# EAGLE design PSPS_AVNC_SRD_power-2020-10-17 (EAGLE 9.6.2)
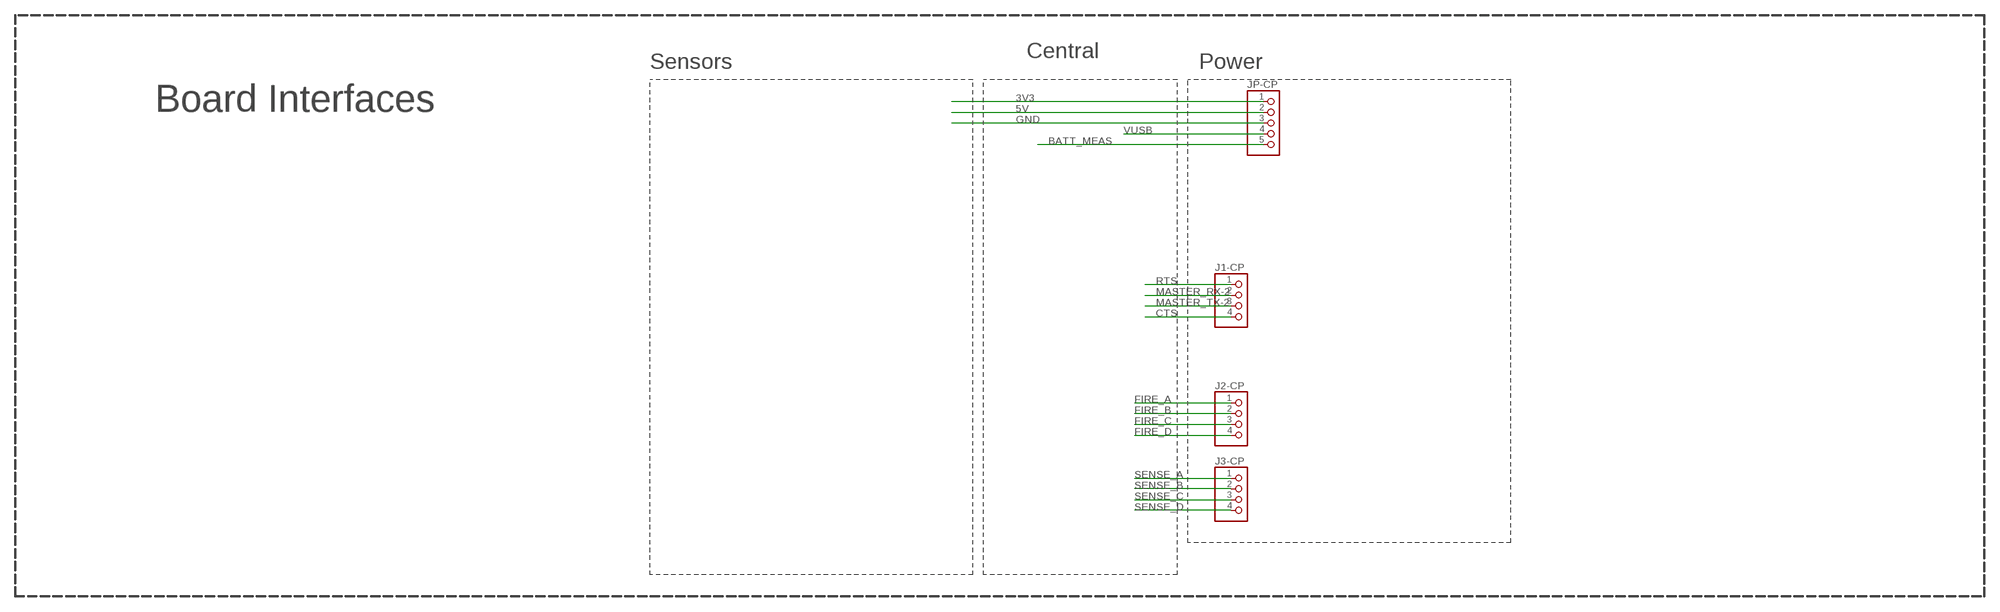
[diagram p0: schematic, sheet 1, part 1 of 3]
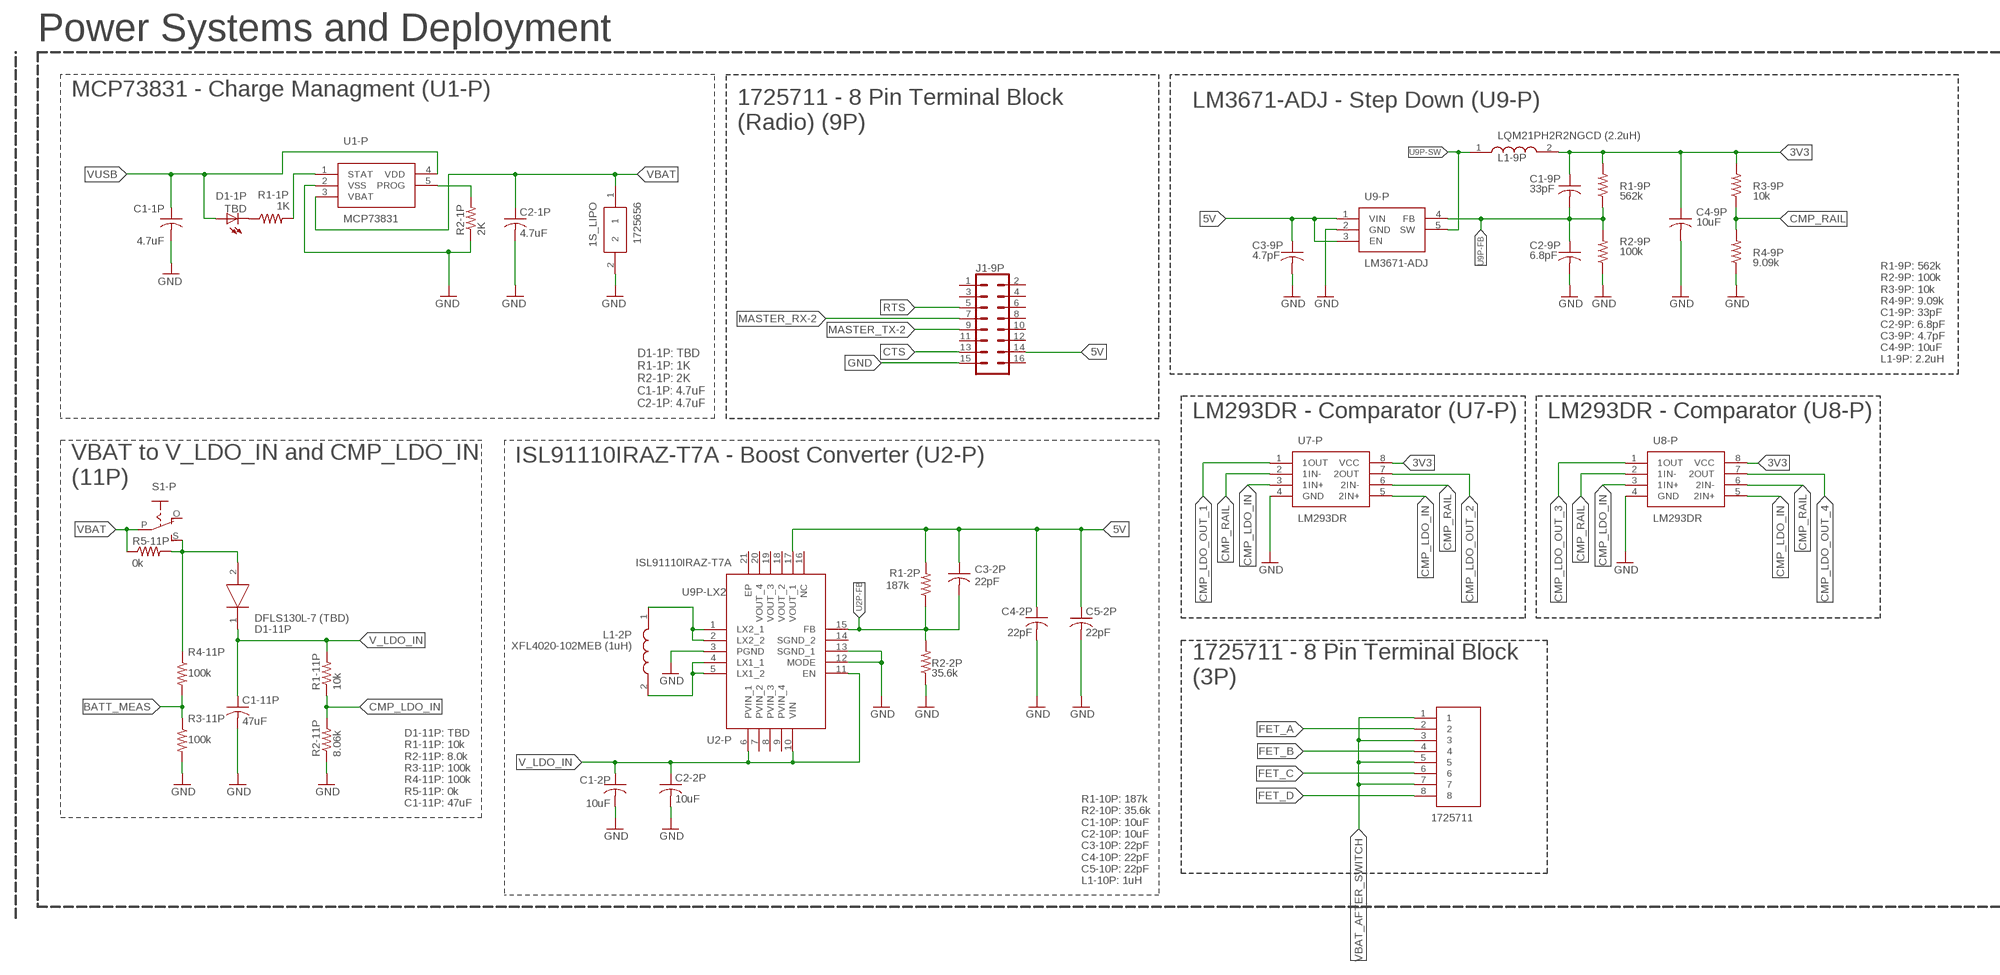
[diagram p1: schematic, sheet 1, part 2 of 3]
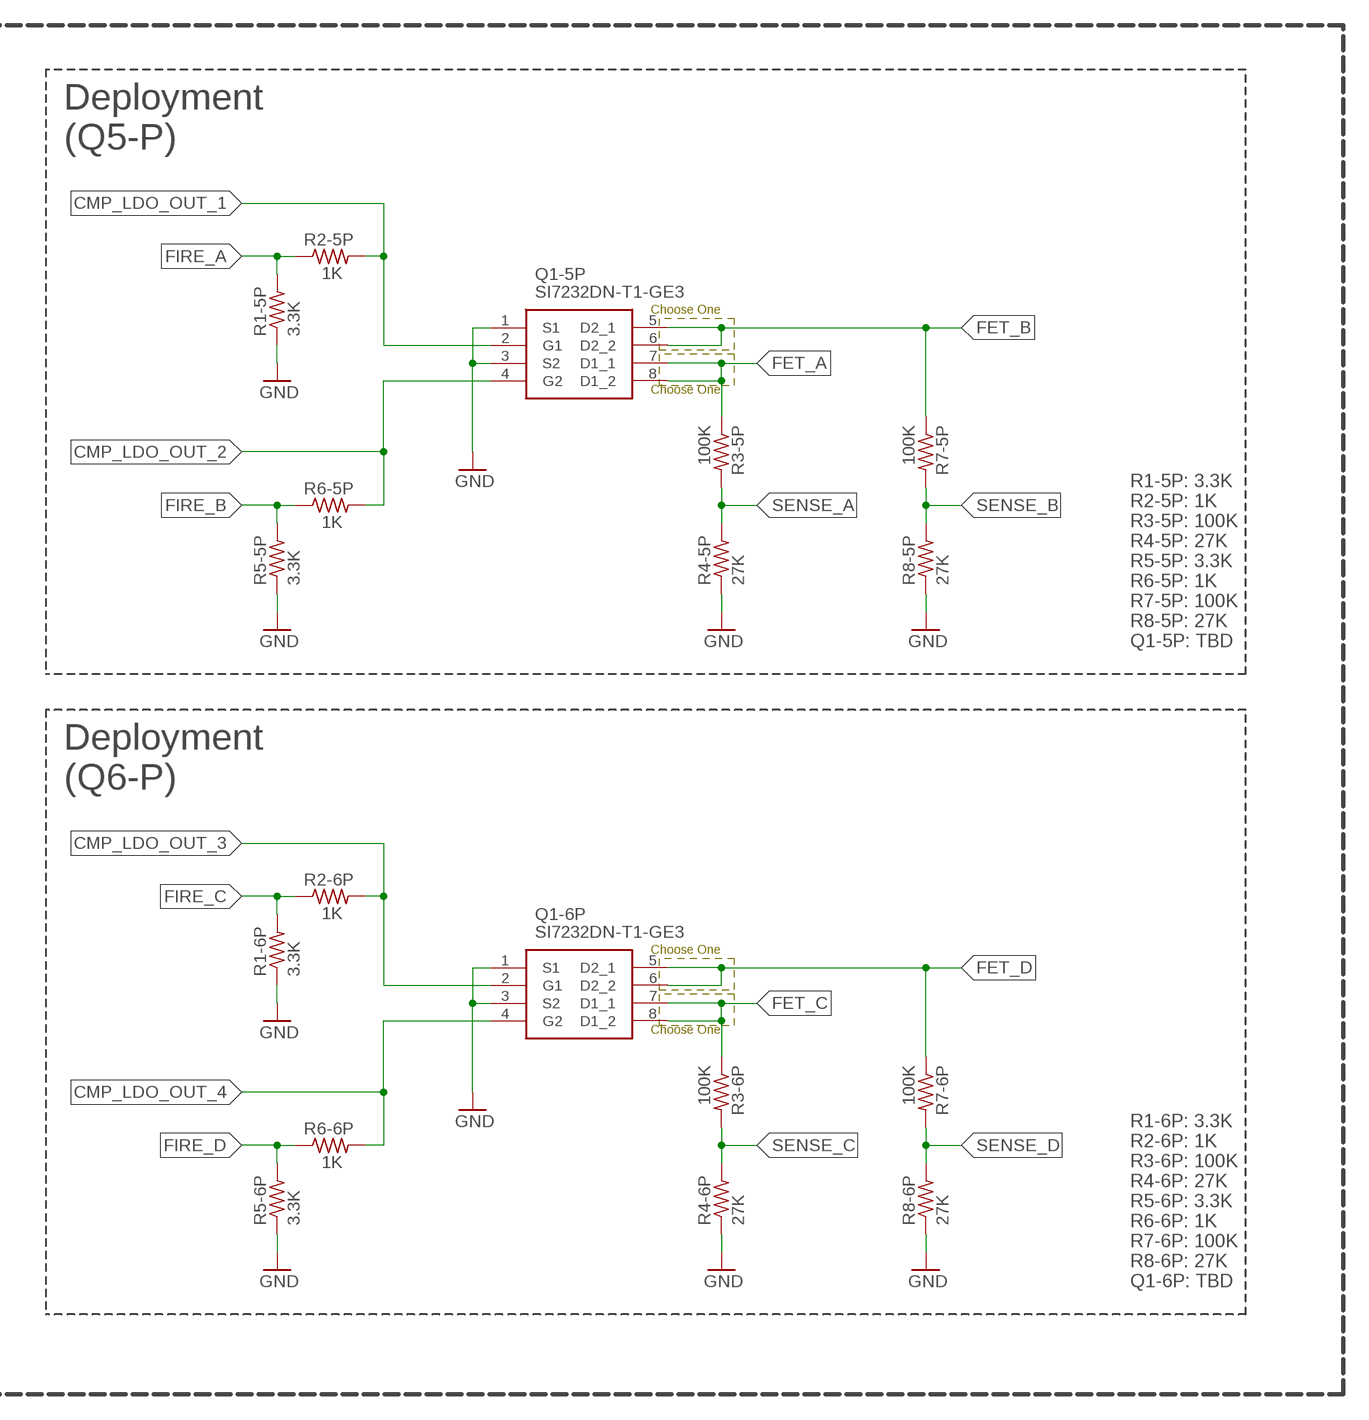
[diagram p2: schematic, sheet 1, part 3 of 3]

## Parts
1S_LIPO  1725656  [1725656]
C1-1P  4.7uF  C-USC0805  [C0805]
C1-2P  10uF  C-USC0805  [C0805]
C1-9P  33pF  C-USC0805  [C0805]
C1-11P  47uF  C-USC0805  [C0805]
C2-1P  4.7uF  C-USC0805  [C0805]
C2-2P  10uF  C-USC0805  [C0805]
C2-9P  6.8pF  C-USC0805  [C0805]
C3-2P  22pF  C-USC0805  [C0805]
C3-9P  4.7pF  C-USC0805  [C0805]
C4-2P  22pF  C-USC0805  [C0805]
C4-9P  10uF  C-USC0805  [C0805]
C5-2P  22pF  C-USC0805  [C0805]
D1-1P  TBD  LEDCHIPLED_0805  [CHIPLED_0805]
D1-11P  DFLS130L-7 (TBD)  DFLS130L-7  [POWERDI_123]
J1-9P  CONN_08X2  [2X8]
J1-CP  PINHD-1X4  [1X04]
J2-CP  PINHD-1X4  [1X04]
J2-P  1725711  [1725711]
J3-CP  PINHD-1X4  [1X04]
JP-CP  PINHD-1X5  [1X05]
L1-2P  XFL4020-102MEB (1uH)  XFL4020-102MEB  [XFL4020]
L1-9P  LQM21PH2R2NGCD (2.2uH)  LQM21PH2R2NGCD  [INDC2012X100N]
Q1-5P  SI7232DN-T1-GE3  [POWERPAK-1212-8]
Q1-6P  SI7232DN-T1-GE3  [POWERPAK-1212-8]
R1-1P  1K  R-US_R0805  [R0805]
R1-2P  187k  R-US_R0805  [R0805]
R1-5P  3.3K  R-US_M0805  [M0805]
R1-6P  3.3K  R-US_M0805  [M0805]
R1-9P  562k  R-US_R0805  [R0805]
R1-11P  10k  R-US_R0805  [R0805]
R2-1P  2K  R-US_R0805  [R0805]
R2-2P  35.6k  R-US_R0805  [R0805]
R2-5P  1K  R-US_M0805  [M0805]
R2-6P  1K  R-US_M0805  [M0805]
R2-9P  100k  R-US_R0805  [R0805]
R2-11P  8.06k  R-US_R0805  [R0805]
R3-5P  100K  R-US_M0805  [M0805]
R3-6P  100K  R-US_M0805  [M0805]
R3-9P  10k  R-US_R0805  [R0805]
R3-11P  100k  R-US_R0805  [R0805]
R4-5P  27K  R-US_M0805  [M0805]
R4-6P  27K  R-US_M0805  [M0805]
R4-9P  9.09k  R-US_R0805  [R0805]
R4-11P  100k  R-US_R0805  [R0805]
R5-5P  3.3K  R-US_M0805  [M0805]
R5-6P  3.3K  R-US_M0805  [M0805]
R5-11P  0k  R-US_R0805  [R0805]
R6-5P  1K  R-US_M0805  [M0805]
R6-6P  1K  R-US_M0805  [M0805]
R7-5P  100K  R-US_M0805  [M0805]
R7-6P  100K  R-US_M0805  [M0805]
R8-5P  27K  R-US_M0805  [M0805]
R8-6P  27K  R-US_M0805  [M0805]
S1-P  EG1218S  [EG1218]
U1-P  MCP73831  MCP73831T-2ACI_OT  [SOT95P270X145-5N]
U2-P  ISL91110IRAZ-T7A  [QFN50P400X400X100-21N]
U7-P  LM293DR  [SOIC127P600X175-8N]
U8-P  LM293DR  [SOIC127P600X175-8N]
U9-P  LM3671-ADJ  LM3671MFX-ADJ_NOPB  [SOT95P280X145-5N]

## Nets
3V3: C1-9P.1 C4-9P.1 JP-CP.1 L1-9P.2 R1-9P.2 R3-9P.2 U7-P.8(VCC) U8-P.8(VCC)
5V: C3-2P.1 C3-9P.1 C4-2P.1 C5-2P.1 J1-9P.14 JP-CP.2 R1-2P.2 U2-P.17(VOUT_1) U9-P.1(VIN) U9-P.3(EN)
BATT_MEAS: JP-CP.5 R3-11P.1 R4-11P.2
CMP_LDO_IN: R1-11P.1 R2-11P.2 U7-P.3(1IN+) U7-P.5(2IN+) U8-P.3(1IN+) U8-P.5(2IN+)
CMP_LDO_OUT_1: Q1-5P.2(G1) R2-5P.2 U7-P.1(1OUT)
CMP_LDO_OUT_2: Q1-5P.4(G2) R6-5P.2 U7-P.7(2OUT)
CMP_LDO_OUT_3: Q1-6P.2(G1) R2-6P.2 U8-P.1(1OUT)
CMP_LDO_OUT_4: Q1-6P.4(G2) R6-6P.2 U8-P.7(2OUT)
CMP_RAIL: R3-9P.1 R4-9P.2 U7-P.2(1IN-) U7-P.6(2IN-) U8-P.2(1IN-) U8-P.6(2IN-)
CTS: J1-9P.13 J1-CP.4
D1-1P_R1-1P: D1-1P.C R1-1P.1
FET_A: J2-P.2 Q1-5P.7(D1_1) Q1-5P.8(D1_2) R3-5P.1
FET_B: J2-P.4 Q1-5P.5(D2_1) Q1-5P.6(D2_2) R7-5P.1
FET_C: J2-P.6 Q1-6P.7(D1_1) Q1-6P.8(D1_2) R3-6P.1
FET_D: J2-P.8 Q1-6P.5(D2_1) Q1-6P.6(D2_2) R7-6P.1
FIRE_A: J2-CP.1 R1-5P.2 R2-5P.1
FIRE_B: J2-CP.2 R5-5P.2 R6-5P.1
FIRE_C: J2-CP.3 R1-6P.2 R2-6P.1
FIRE_D: J2-CP.4 R5-6P.2 R6-6P.1
GND: 1S_LIPO.2 C1-1P.2 C1-2P.2 C1-11P.2 C2-1P.2 C2-2P.2 C2-9P.2 C3-9P.2 C4-2P.2 C4-9P.2 C5-2P.2 J1-9P.15 JP-CP.3 Q1-5P.1(S1) Q1-5P.3(S2) Q1-6P.1(S1) Q1-6P.3(S2) R1-5P.1 R1-6P.1 R2-1P.1 R2-2P.1 R2-9P.1 R2-11P.1 R3-11P.2 R4-5P.1 R4-6P.1 R4-9P.1 R5-5P.1 R5-6P.1 R8-5P.1 R8-6P.1 U1-P.2(VSS) U2-P.3(PGND) U2-P.12(MODE) U2-P.13(SGND_1) U7-P.4(GND) U8-P.4(GND) U9-P.2(GND)
MASTER_RX-2: J1-9P.7 J1-CP.2
MASTER_TX-2: J1-9P.9 J1-CP.3
RTS: J1-9P.5 J1-CP.1
SENSE_A: J3-CP.1 R3-5P.2 R4-5P.2
SENSE_B: J3-CP.2 R7-5P.2 R8-5P.2
SENSE_C: J3-CP.3 R3-6P.2 R4-6P.2
SENSE_D: J3-CP.4 R7-6P.2 R8-6P.2
U1P-PROG: R2-1P.2 U1-P.5(PROG)
U1P-STAT: R1-1P.2 U1-P.1(STAT)
U2P-FB: C3-2P.2 R1-2P.1 R2-2P.2 U2-P.15(FB)
U9P-FB: C1-9P.2 C2-9P.1 R1-9P.1 R2-9P.2 U9-P.4(FB)
U9P-LX1: L1-2P.2 U2-P.4(LX1_1) U2-P.5(LX1_2)
U9P-LX2: L1-2P.1 U2-P.1(LX2_1) U2-P.2(LX2_2)
U9P-SW: L1-9P.1 U9-P.5(SW)
V_LDO_IN: C1-2P.1 C1-11P.1 C2-2P.1 D1-11P.1(K) R1-11P.2 U2-P.6(PVIN_1) U2-P.10(VIN) U2-P.11(EN)
VBAT: 1S_LIPO.1 C2-1P.1 R5-11P.1 S1-P.P U1-P.3(VBAT)
VBAT_AFTER_SWITCH: D1-11P.2(A) J2-P.1 J2-P.3 J2-P.5 J2-P.7 R4-11P.1 R5-11P.2 S1-P.S
VUSB: C1-1P.1 D1-1P.A JP-CP.4 U1-P.4(VDD)
Unconnected: J1-9P.1 J1-9P.2 J1-9P.3 J1-9P.4 J1-9P.6 J1-9P.8 J1-9P.10 J1-9P.11 J1-9P.12 J1-9P.16 S1-P.O U2-P.7(PVIN_2) U2-P.8(PVIN_3) U2-P.9(PVIN_4) U2-P.14(SGND_2) U2-P.16(NC) U2-P.18(VOUT_2) U2-P.19(VOUT_3) U2-P.20(VOUT_4) U2-P.21(EP)

## Notes on the sheet
- Power Systems and Deployment
- MCP73831 - Charge Managment (U1-P)
- LM3671-ADJ - Step Down (U9-P)
- 1725711 - 8 Pin Terminal Block 
  (Radio) (9P)
- Deployment
  (Q5-P)
- Choose One
- Choose One
- R1-9P: 562k
  R2-9P: 100k
  R3-9P: 10k
  R4-9P: 9.09k
  C1-9P: 33pF
  C2-9P: 6.8pF
  C3-9P: 4.7pF
  C4-9P: 10uF
  L1-9P: 2.2uH
- D1-1P: TBD
  R1-1P: 1K
  R2-1P: 2K
  C1-1P: 4.7uF
  C2-1P: 4.7uF
- LM293DR - Comparator (U7-P) | LM293DR - Comparator (U8-P)
- R1-5P: 3.3K
  R2-5P: 1K
  R3-5P: 100K
  R4-5P: 27K
  R5-5P: 3.3K
  R6-5P: 1K
  R7-5P: 100K
  R8-5P: 27K
  Q1-5P: TBD
- ISL91110IRAZ-T7A - Boost Converter (U2-P)
- VBAT to V_LDO_IN and CMP_LDO_IN
  (11P)
- Deployment
  (Q6-P)
- Choose One
- Choose One
- 1725711 - 8 Pin Terminal Block
  (3P)
- D1-11P: TBD
  R1-11P: 10k
  R2-11P: 8.0k
  R3-11P: 100k
  R4-11P: 100k
  R5-11P: 0k
  C1-11P: 47uF
- R1-6P: 3.3K
  R2-6P: 1K
  R3-6P: 100K
  R4-6P: 27K
  R5-6P: 3.3K
  R6-6P: 1K
  R7-6P: 100K
  R8-6P: 27K
  Q1-6P: TBD
- R1-10P: 187k
  R2-10P: 35.6k
  C1-10P: 10uF
  C2-10P: 10uF
  C3-10P: 22pF
  C4-10P: 22pF
  C5-10P: 22pF
  L1-10P: 1uH
- Central
- Sensors | Power
- Board Interfaces

## Library data of the parts
1S_LIPO = SamacSys_Parts:1725656: 2 way PCB vertical mount terminal,2.54mm 2 way PCB vertical mount terminal,2.54mm Source: Datasheet; DESCRIPTION: 2 way PCB vertical mount terminal,2.54mm 2 way PCB vertical mount terminal,2.54mm; HEIGHT: 8mm; MANUFACTURER_NAME: Phoenix Contact; MANUFACTURER_PART_NUMBER: 1725656; MOUSER_PART_NUMBER: 651-1725656; MOUSER_PRICE-STOCK: https://www.mouser.com/Search/Refine.aspx?Keyword=651-1725656
C1-1P C1-2P C1-9P C1-11P C2-1P C2-9P C3-2P C3-9P C4-9P = resistor:C-US: CAPACITOR, American symbol
C2-2P C5-2P = BeagleBone_Black_Wireless:C-US: CAPACITOR, American symbol
C4-2P = resistor:C-US: CAPACITOR, American symbol; SPICEPREFIX: C
D1-1P = adafruit:LED: LED OSRAM: - CHIPLED LG R971, LG N971, LY N971, LG Q971, LY Q971, LO R971, LY R971 LH N974, LH R974 LS Q976, LO Q976, LY Q976 LO Q996 - Hyper CHIPLED LW Q18S LB Q993, LB Q99A, LB R99A - SideLED LS A670, LO A670, LY A670, LG A670, LP A670 LB A673, LV A673, LT A673, LW A673 LH A674 LY A675 LS A676, LA A676, LO A676, LY A676, LW A676 LS A679, LY A679, LG A679 - Hyper Micro SIDELED® LS Y876, LA Y876, LO Y876, LY Y876 LT Y87S - SmartLED LW L88C, LW L88S LB L89C, LB L89S, LG L890 LS L89K, LO L89K, LY L89K LS L896, LA L896, LO L896, LY L896 - TOPLED LS T670, LO T670, LY T670, LG T670, LP T670 LSG T670, LSP T670, LSY T670, LOP T670, LYG T670 LG T671, LOG T671, LSG T671 LB T673, LV T673, LT T673, LW T673 LH T674 LS T676, LA T676, LO T676, LY T676, LB T676, LH T676, LSB T676, LW T676 LB T67C, LV T67C, LT T67C, LS T67K, LO T67K, LY T67K, LW E67C LS E67B, LA E67B, LO E67B, LY E67B, LB E67C, LV E67C, LT E67C LW T67C LS T679, LY T679, LG T679 LS T770, LO T770, LY T770, LG T770, LP T770 LB T773, LV T773, LT T773, LW T773 LH T774 LS E675, LA E675, LY E675, LS T675 LS T776, LA T776, LO T776, LY T776, LB T776 LHGB T686 LT T68C, LB T68C - Hyper Mini TOPLED® LB M676 - Mini TOPLED Santana® LG M470 LS M47K, LO M47K, LY M47K Source: http://www.osram.convergy.de/
D1-11P = SamacSys_Parts:DFLS130L-7: 1.0A SURFACE MOUNT SCHOTTKY BARRIER RECTIFIER Source: Datasheet; DESCRIPTION: 1.0A SURFACE MOUNT SCHOTTKY BARRIER RECTIFIER; HEIGHT: mm; MANUFACTURER_NAME: Diodes Inc.; MANUFACTURER_PART_NUMBER: DFLS130L-7; MOUSER_PART_NUMBER: 621-DFLS130L; MOUSER_PRICE-STOCK: https://www.mouser.com/Search/Refine.aspx?Keyword=621-DFLS130L
J1-9P = SparkFun-Connectors:CONN_08X2: Multi connection point. Often used as Generic Header-pin footprint for 0.1 inch spaced/style header connections You can populate with any combo of single row headers, but if you'd like an exact match, check this: Header - 2x8 (Male, 0.1") (PRT-13156) On any of the 0.1 inch spaced packages, you can populate with these: Break Away Headers - Straight (PRT-00116) Break Away Male Headers - Right Angle (PRT-00553) Female Headers (PRT-00115) Break Away Headers - Machine Pin (PRT-00117) Break Away Female Headers - Swiss Machine Pin (PRT-00743)
J1-CP J2-CP J3-CP = pinhead:PINHD-1X4: PIN HEADER
J2-P = SamacSys_Parts:1725711: 8 way PCB vertical mount terminal,2.54mm 8 way PCB vertical mount terminal,2.54mm Source: Datasheet; DESCRIPTION: 8 way PCB vertical mount terminal,2.54mm 8 way PCB vertical mount terminal,2.54mm; HEIGHT: mm; MANUFACTURER_NAME: Phoenix Contact; MANUFACTURER_PART_NUMBER: 1725711; MOUSER_PART_NUMBER: 651-1725711; MOUSER_PRICE-STOCK: https://www.mouser.com/Search/Refine.aspx?Keyword=651-1725711
JP-CP = pinhead:PINHD-1X5: PIN HEADER
L1-2P = SamacSys_Parts:XFL4020-102MEB: Fixed Inductors XFL4020 AEC-Q200 1 uH 20% 11 A Compos Source: Datasheet; DESCRIPTION: Fixed Inductors XFL4020 AEC-Q200 1 uH 20% 11 A Compos; HEIGHT: mm; MANUFACTURER_NAME: COILCRAFT; MANUFACTURER_PART_NUMBER: XFL4020-102MEB; MOUSER_PART_NUMBER: 994-XFL4020-102MEB; MOUSER_PRICE-STOCK: https://www.mouser.com/Search/Refine.aspx?Keyword=994-XFL4020-102MEB
L1-9P = SamacSys_Parts:LQM21PH2R2NGCD: LQM21PH_GC Series Inductor 2.2uH +/-30% 0805 (2012) Source: Datasheet; DESCRIPTION: LQM21PH_GC Series Inductor 2.2uH +/-30% 0805 (2012); HEIGHT: 1mm; MANUFACTURER_NAME: Murata Electronics; MANUFACTURER_PART_NUMBER: LQM21PH2R2NGCD; MOUSER_PART_NUMBER: 81-LQM21PH2R2NGCD; MOUSER_PRICE-STOCK: https://www.mouser.com/Search/Refine.aspx?Keyword=81-LQM21PH2R2NGCD
Q1-5P Q1-6P = SamacSys_Parts:SI7232DN-T1-GE3: Trans MOSFET N-CH 20V 10An Vishay SI7232DN-T1-GE3 Dual N-channel MOSFET Transistor, 24 A, 20 V, 8-Pin PowerPAK 1212 Source: Datasheet; ARROW_PART_NUMBER: SI7232DN-T1-GE3; ARROW_PRICE-STOCK: https://www.arrow.com/en/products/si7232dn-t1-ge3/vishay; DESCRIPTION: Trans MOSFET N-CH 20V 10An Vishay SI7232DN-T1-GE3 Dual N-channel MOSFET Transistor, 24 A, 20 V, 8-Pin PowerPAK 1212; HEIGHT: mm; MANUFACTURER_NAME: Vishay; MANUFACTURER_PART_NUMBER: SI7232DN-T1-GE3; MOUSER_PART_NUMBER: 781-SI7232DN-GE3; MOUSER_PRICE-STOCK: https://www.mouser.co.uk/ProductDetail/Vishay-Semiconductors/SI7232DN-T1-GE3?qs=%252BPu8jn5UVnH5FJ8Jo4EbFw%3D%3D
R1-1P R1-2P R1-9P R1-11P R2-1P R2-2P R2-9P R2-11P R3-9P R4-9P = resistor:R-US_: RESISTOR, American symbol
R1-5P R1-6P R2-5P R2-6P R3-5P R3-6P R4-5P R4-6P R5-5P R5-6P R6-5P R6-6P R7-5P R7-6P R8-5P R8-6P = rcl:R-US_: RESISTOR, American symbol; SPICEPREFIX: R
R3-11P R4-11P R5-11P = PulseOximeterECG_AU:R-US_: RESISTOR, American symbol; SPICEPREFIX: R
S1-P = adafruit:EG1218: SLIDING SWITCH 0.1" spacing through hole, vertical SPDT slide switch http://www.ladyada.net/library/pcb/eaglelibrary.html
U1-P = SamacSys_Parts:MCP73831T-2ACI_OT: Li-Ion Charge Controller 4.2V SOT23-5 Source: Datasheet; DESCRIPTION: Li-Ion Charge Controller 4.2V SOT23-5; HEIGHT: 1.45mm; MANUFACTURER_NAME: Microchip; MANUFACTURER_PART_NUMBER: MCP73831T-2ACI/OT; MOUSER_PART_NUMBER: 579-MCP73831T-2ACIOT; MOUSER_PRICE-STOCK: https://www.mouser.co.uk/ProductDetail/Microchip-Technology/MCP73831T-2ACI-OT?qs=yUQqVecv4qvbBQBGbHx0Mw%3D%3D
U2-P = SamacSys_Parts:ISL91110IRAZ-T7A: Integrated FET Regulators High Current Buck Boost Switching Regulator Delivering 2A of Continuous Output Current Source: Datasheet; DESCRIPTION: Integrated FET Regulators High Current Buck Boost Switching Regulator Delivering 2A of Continuous Output Current; HEIGHT: 1mm; MANUFACTURER_NAME: Renesas Electronics; MANUFACTURER_PART_NUMBER: ISL91110IRAZ-T7A
U7-P U8-P = SamacSys_Parts:LM293DR: Dual differential comparator, industrial grade Source: Datasheet; DESCRIPTION: Dual differential comparator, industrial grade; HEIGHT: 1.75mm; MANUFACTURER_NAME: Texas Instruments; MANUFACTURER_PART_NUMBER: LM293DR; MOUSER_PART_NUMBER: 595-LM293DR; MOUSER_PRICE-STOCK: https://www.mouser.com/Search/Refine.aspx?Keyword=595-LM293DR
U9-P = SamacSys_Parts:LM3671MFX-ADJ_NOPB: 2MHz, 600mA Step-Down DC-DC Converter Source: Datasheet; DESCRIPTION: 2MHz, 600mA Step-Down DC-DC Converter; HEIGHT: 1.45mm; MANUFACTURER_NAME: Texas Instruments; MANUFACTURER_PART_NUMBER: LM3671MFX-ADJ/NOPB; MOUSER_PART_NUMBER: 926-LM3671MFXADJNOPB; MOUSER_PRICE-STOCK: https://www.mouser.com/Search/Refine.aspx?Keyword=926-LM3671MFXADJNOPB

## Board
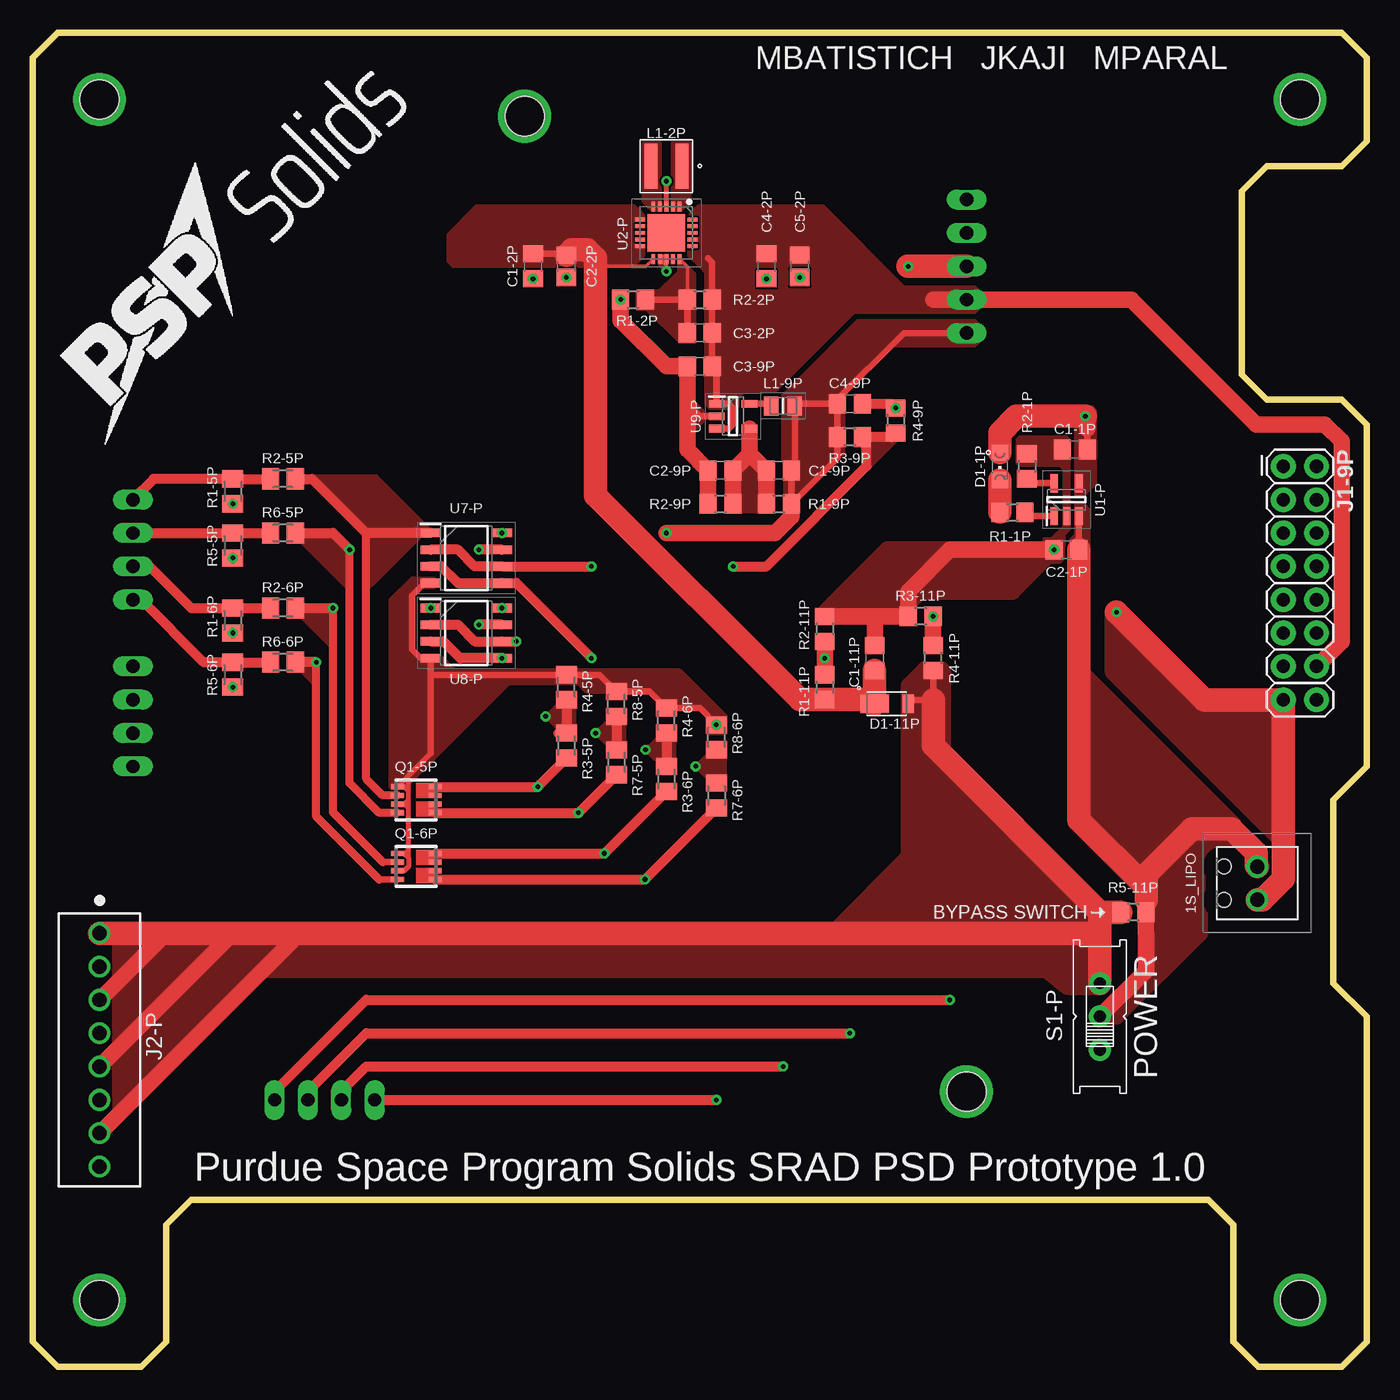
[diagram p3: board, top side]
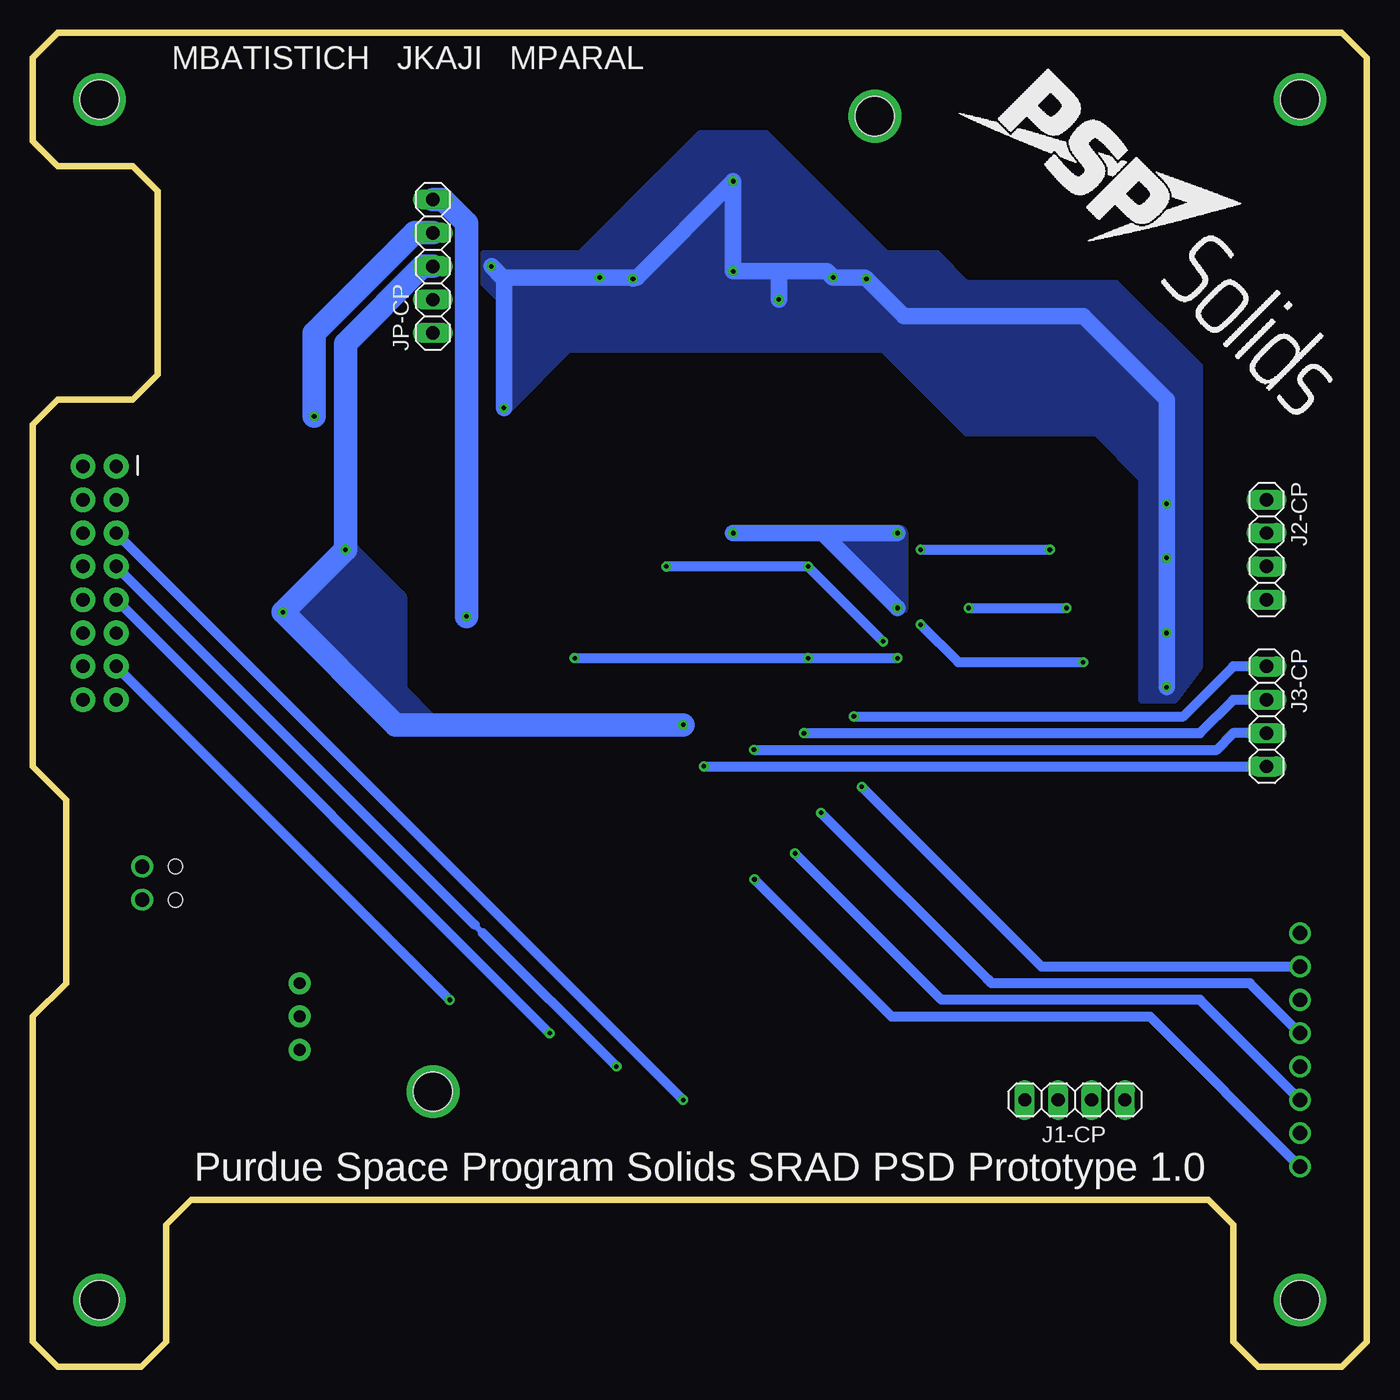
[diagram p4: board, bottom side, seen from below]

Size 101.6 x 101.6 mm. Coordinates in mm from the lower left corner, seen from the top.
Outline: 1.91,0 8.26,0 10.16,1.91 10.16,10.79 12.06,12.7 89.53,12.7 91.44,10.79 91.44,1.91 93.34,0 99.69,0 101.6,1.91 101.6,26.67 99.06,29.21 99.06,43.18 101.6,45.72 101.6,71.75 99.69,73.66 93.98,73.66 92.08,75.56 92.08,89.53 93.98,91.44 99.69,91.44 101.6,93.34 101.6,99.69 99.69,101.6 1.91,101.6 0,99.69 0,1.91 1.91,0
Copper layers (1*16): Top 0.035mm / dielectric 1.5mm / Bottom 0.035mm
Design rules "default *": minimum track width 6mil, minimum drill 0.35mm, track to track 6mil, track to pad 6mil, pad to pad 6mil, via to via 6mil, smd to smd 6mil, copper to edge 40mil, drill to drill 6mil, minimum pad ring 10mil, minimum via ring 8mil, stop-mask expansion 4mil, vias tented up to drill 0mil, thermal gap 10mil
Holes 3 mm at 5.08,96.52 96.52,96.52 96.52,5.08 5.08,5.08 71.12,20.95 37.47,95.25

### Footprints (pad centres in the part's own frame; a part is rotated, then mirrored left to right if it is on the bottom)
1725656 = drill 1.1 pad 1.65: 1 -1.27,3.1; 2 1.27,3.1 | hole 1.1: -1.27,0.56; 1.27,0.56
C0805 = smd 1.3 x 1.5: 1 -0.95,0; 2 0.95,0
C0805' = smd 1.3 x 1.5: 1 -0.85,0; 2 0.85,0
CHIPLED_0805 = smd 1.2 x 1.2: A 0,-1.05; C 0,1.05
POWERDI_123 = smd 2.2 x 1.4: 1 -1.6,0 | smd 0.9 x 1.4: 2 0.95,0
2X8 = drill 1.016 pad 1.88: 1 0,0; 2 0,2.54; 3 2.54,0; 4 2.54,2.54; 5 5.08,0; 6 5.08,2.54; 7 7.62,0; 8 7.62,2.54; 9 10.16,0; 10 10.16,2.54; 11 12.7,0; 12 12.7,2.54; 13 15.24,0; 14 15.24,2.54; 15 17.78,0; 16 17.78,2.54
1X04 = drill 1.016 long: 1 -3.81,0; 2 -1.27,0; 3 1.27,0; 4 3.81,0
1725711 = drill 1.1 pad 1.65: 1 -8.89,0; 2 -6.35,0; 3 -3.81,0; 4 -1.27,0; 5 1.27,0; 6 3.81,0; 7 6.35,0; 8 8.89,0
1X05 = drill 1.016 long: 1 -5.08,0; 2 -2.54,0; 3 0,0; 4 2.54,0; 5 5.08,0
XFL4020 = smd 0.98 x 3.4: 1 -1.185,0; 2 1.185,0
INDC2012X100N = smd 1.1 x 1.45: 1 -0.9,0; 2 0.9,0
POWERPAK-1212-8 = smd 0.99 x 0.405: 1 -1.435,0.99; 2 -1.435,0.33; 3 -1.435,-0.33; 4 -1.435,-0.99; 5 1.435,-0.99; 6 1.435,-0.33; 7 1.435,0.33; 8 1.435,0.99
R0805 = smd 1.3 x 1.5: 1 -0.95,0; 2 0.95,0
M0805 = smd 1.3 x 1.6: 1 -0.95,0; 2 0.95,0
EG1218 = drill 0.9 pad 1.676: O -2.54,0; P 0,0; S 2.54,0
SOT95P270X145-5N = smd 1.4 x 0.6: 1 -1.25,0.95; 2 -1.25,0; 3 -1.25,-0.95; 4 1.25,-0.95; 5 1.25,0.95
QFN50P400X400X100-21N = smd 0.75 x 0.3: 1 -2,1; 2 -2,0.5; 3 -2,0; 4 -2,-0.5; 5 -2,-1; 11 2,-1; 12 2,-0.5; 13 2,0; 14 2,0.5; 15 2,1 | smd 0.3 x 0.75: 6 -1,-2; 7 -0.5,-2; 8 0,-2; 9 0.5,-2; 10 1,-2; 16 1,2; 17 0.5,2; 18 0,2; 19 -0.5,2; 20 -1,2 | smd 2.85 x 2.85: 21 0,0
SOIC127P600X175-8N = smd 1.525 x 0.65: 1 -2.712,1.905; 2 -2.712,0.635; 3 -2.712,-0.635; 4 -2.712,-1.905; 5 2.712,-1.905; 6 2.712,-0.635; 7 2.712,0.635; 8 2.712,1.905
SOT95P280X145-5N = smd 1.2 x 0.6: 1 -1.25,0.95; 2 -1.25,0; 3 -1.25,-0.95; 4 1.25,-0.95; 5 1.25,0.95

### Placement (x,y rotation side)
1S_LIPO  90.17,36.83 270 top
C1-1P  79.38,69.85 180 top
C1-2P  38.1,83.82 270 top
C1-9P  56.83,68.26 180 top
C1-11P  64.14,53.98 90 top
C2-1P  78.74,62.23 180 top
C2-2P  10uF  [C0805']  40.64,83.82 270 top
C2-9P  52.39,68.26 180 top
C3-2P  50.8,78.74 180 top
C3-9P  50.8,76.2 180 top
C4-2P  55.88,83.82 270 top
C4-9P  62.23,73.34 0 top
C5-2P  22pF  [C0805']  58.42,83.82 270 top
D1-1P  73.66,68.58 180 top
D1-11P  65.72,50.48 0 top
J1-9P  95.25,68.58 270 top
J1-CP  22.23,20.32 0 bottom
J2-CP  7.62,62.23 270 bottom
J2-P  5.08,24.13 270 top
J3-CP  7.62,49.53 270 bottom
JP-CP  71.12,83.82 90 bottom
L1-2P  48.26,91.44 180 top
L1-9P  57.15,73.18 0 top
Q1-5P  29.21,43.18 0 top
Q1-6P  29.21,38.1 0 top
R1-1P  74.61,65.09 0 top
R1-2P  50.8,81.28 0 top
R1-5P  15.24,66.67 90 top
R1-6P  15.24,56.83 90 top
R1-9P  56.83,65.72 0 top
R1-11P  60.33,51.75 270 top
R2-1P  75.72,68.58 270 top
R2-2P  45.72,81.28 0 top
R2-5P  19.05,67.63 0 top
R2-6P  19.05,57.78 0 top
R2-9P  52.39,65.72 0 top
R2-11P  60.33,56.2 270 top
R3-5P  40.64,47.31 90 top
R3-6P  48.26,44.77 90 top
R3-9P  62.23,70.8 180 top
R3-11P  67.63,57.15 180 top
R4-5P  40.64,51.75 270 top
R4-6P  48.26,49.21 270 top
R4-9P  65.72,72.07 270 top
R4-11P  68.58,53.98 90 top
R5-5P  15.24,62.55 90 top
R5-6P  15.24,52.7 90 top
R5-11P  83.82,34.61 180 top
R6-5P  19.05,63.5 0 top
R6-6P  19.05,53.66 0 top
R7-5P  44.45,46.04 90 top
R7-6P  52.07,43.5 90 top
R8-5P  44.45,50.48 270 top
R8-6P  52.07,47.94 270 top
S1-P  81.28,26.67 90 top
U1-P  78.74,66.04 90 top
U2-P  48.26,86.36 270 top
U7-P  33.02,61.59 0 top
U8-P  33.02,55.88 0 top
U9-P  53.34,72.39 0 top

### Tracks (layer width: path | path; a pad name or v marks a point on that pad's centre or on a via)
3V3  (via drill 0.35)
  Top 0.508: R3-9P.2 61.28,71.12 | 60.96,73.34 C4-9P.1 R3-9P.2 | 60.96,73.34 58.21,73.34 L1-9P.2 58.05,68.53 C1-9P.1 R1-9P.2 61.28,69.22 R3-9P.2 | JP-CP.1 66.36,78.74 60.96,73.34
  Top 1.27: R1-9P.2 57.78,64.77 56.52,63.5 v48.26,63.5
  Bottom 1.27: U7-P.8 v48.26,63.5 41.45,63.5 v35.73,57.78
  other vias: 35.73,63.5
  pour Top (no thermals): 71.75,79.69 62.87,79.69 57.15,73.98 57.15,69.06 57.31,68.9 57.31,66.04 58.26,66.04 61.75,69.53 61.75,73.98 65.56,77.79 71.75,77.79 72.39,78.42 72.39,79.06
  pour Bottom (no thermals): 35.56,63.5 35.56,57.78 41.27,63.5
5V
  Top 0.508: C4-2P.1 55.98,84.67 | 58.48,84.61 C5-2P.1 | 51.44,84.45 51.75,84.14 R1-2P.2 C3-2P.1 | U9-P.3 53.02,71.44 53.34,71.75 53.34,73.03 53.02,73.34 U9-P.1 52.09,75.86 C3-9P.1 C3-2P.1 | C3-2P.1 51.75,78.67
  Top 1.27: J1-9P.14 99.69,55.24 99.69,70.48 98.42,71.75 93.19,71.75 83.67,81.28 68.58,81.28
  pour Top (no thermals): 62.99,83.82 50.8,83.82 49.99,84.63 49.99,87.71 50.67,88.39 60.07,88.39 62.99,85.47
  pour Top (no thermals): 50.8,83.82 51.28,83.34 51.28,73.34 51.59,73.03 53.5,73.03 53.66,73.18 53.66,73.82 62.99,83.15 62.99,84.14 51.12,84.14
  pour Top (no thermals): 62.55,80.33 71.75,80.33 72.23,80.8 72.23,81.76 71.75,82.23 66.36,82.23 60.17,88.42 60.17,80.33 54.13,74.3 56.52,74.3
BATT_MEAS  (via drill 0.35)
  Top 1.27: R4-11P.2 R3-11P.1
  Bottom 1.778: R3-11P.1 68.58,77.97 68.56,77.99 68.56,87.11 70.35,88.9 JP-CP.5
  other vias: 68.58,57.15
CMP_LDO_IN  (via drill 0.35)
  Top 0.508: R2-11P.2 60.64,55.25
  Top 0.762: U8-P.3 31.27,55.24 32.55,53.98 U8-P.5 | U7-P.3 31.11,60.96 32.38,59.69 U7-P.5 36.83,59.69 v42.55,53.98
  Top 1.27: R2-11P.2 v60.33,53.98 R1-11P.1
  Bottom 0.762: v60.33,53.98 v42.55,53.98 U8-P.5
  other vias: 35.73,53.98
CMP_LDO_OUT_1
  Top 0.508: 20.32,67.63 R2-5P.2
  Top 0.61: Q1-5P.2 26.66,43.51 25.4,44.77 25.4,63.5
  Top 0.762: U7-P.1 25.4,63.5 21.27,67.63 20.32,67.63
  pour Top (no thermals): 21.27,67.63 26.04,67.63 30.16,63.5 25.4,63.5
  pour Top (no thermals): 29.53,63.5 25.72,59.69 25.4,59.37 25.4,63.5
CMP_LDO_OUT_2  (via drill 0.35)
  Top 0.61: Q1-5P.4 26.39,42.19 24.13,44.45 v24.13,62.23
  Top 0.762: U7-P.7 v33.97,62.23 | v24.13,62.23 22.86,63.5 R6-5P.2
  Bottom 0.762: v33.97,62.23 v24.13,62.23
  pour Top (no thermals): 20,63.5 24.13,59.37 24.13,62.23 22.86,63.5
CMP_LDO_OUT_3  (via drill 0.35)
  Top 0.508: Q1-6P.2 26.66,38.43
  Top 0.61: 26.66,38.43 22.86,42.23 v22.86,57.78
  Top 0.762: R2-6P.2 v22.86,57.78
  Bottom 0.762: v30.31,57.78 v22.86,57.78
  pour Top (no thermals): 22.86,57.78 20,57.78 22.86,54.93
CMP_LDO_OUT_4  (via drill 0.35)
  Top 0.508: Q1-6P.4 26.39,37.11
  Top 0.61: 26.39,37.11 21.59,41.91 v21.59,53.66
  Top 0.762: U8-P.7 v33.97,56.52 | v21.59,53.66 R6-6P.2
  Bottom 0.762: v33.97,56.52 31.11,53.66 v21.59,53.66
  pour Top (no thermals): 21.59,53.66 20,53.66 21.59,52.07
CMP_RAIL  (via drill 0.35)
  Top 0.508: 30.48,56.52 U8-P.2 | R4-9P.2 65.4,70.8 | 63.5,70.8 R3-9P.1
  Top 0.762: U8-P.2 32.38,56.52 33.66,55.24 U8-P.6 v36.83,55.24 | U7-P.2 32.38,62.23 33.66,60.96 U7-P.6 v42.55,60.96 | 65.4,70.8 63.5,70.8 63.5,68.58 55.88,60.96 v53.34,60.96
  Bottom 0.762: v36.83,55.24 v42.55,60.96 v53.34,60.96
  pour Top (no thermals): 63.5,70.8 63.5,68.58 65.72,70.8
CTS  (via drill 0.35)
  Top 0.762: J1-CP.4 18.41,20.95 25.4,27.94 v69.85,27.94
  Bottom 0.762: v69.85,27.94 J1-9P.13
D1-1P_R1-1P
  Top 1.778: D1-1P.C R1-1P.1
FET_A  (via drill 0.35)
  Top 0.254: Q1-5P.7 Q1-5P.8
  Top 0.762: R3-5P.1 v38.45,44.17 Q1-5P.8
  Bottom 0.762: v38.45,44.17 24.76,30.48 J2-P.2
FET_B  (via drill 0.35)
  Top 0.254: Q1-5P.6 Q1-5P.5
  Top 0.762: Q1-5P.5 v41.55,42.19 R7-5P.1
  Bottom 0.762: v41.55,42.19 28.89,29.53 28.57,29.21 8.89,29.21 J2-P.4
FET_C  (via drill 0.35)
  Top 0.254: Q1-6P.8 Q1-6P.7
  Top 0.762: Q1-6P.8 v43.53,39.09 R3-6P.1
  Bottom 0.762: J2-P.6 12.7,27.94 32.38,27.94 v43.53,39.09
FET_D  (via drill 0.35)
  Top 0.254: Q1-6P.6 Q1-6P.5
  Top 0.762: 30.68,37.15 Q1-6P.5 v46.63,37.11 R7-6P.1
  Bottom 0.762: v46.63,37.11 36.19,26.67 16.51,26.67 J2-P.8
FIRE_A
  Top 0.508: R2-5P.1
  Top 0.762: R2-5P.1 R1-5P.2 9.21,67.62 J2-CP.1
FIRE_B
  Top 0.508: J2-CP.2 | R5-5P.2
  Top 0.762: J2-CP.2 R5-5P.2 | R5-5P.2 R6-5P.1
FIRE_C
  Top 0.508: R1-6P.2 | R2-6P.1
  Top 0.762: R1-6P.2 12.06,57.78 8.89,60.96 J2-CP.3 8.26,60.96 | R1-6P.2 R2-6P.1
FIRE_D
  Top 0.508: R6-6P.1
  Top 0.762: R6-6P.1 R5-6P.2 13.02,53.66 8.26,58.42 J2-CP.4
GND  (via drill 0.35)
  Top 0.254: 47.79,84.6 48.26,84.6 U2-P.13 48.26,83.86 | 48.26,83.86 v48.26,83.44 | U2-P.12 48.26,83.86
  Top 0.381: U2-P.3 v48.26,90.3 | 28.61,43.16 28.61,43.85 | 28.61,43.85 28.31,44.16 27.79,44.16 Q1-5P.1 28.47,44.87 | 28.61,43.16 28.31,42.86 27.79,42.86 Q1-5P.3 28.31,42.85 28.61,42.55 | 30.31,46.7 28.47,44.87 | 28.61,38.77 28.3,39.09 Q1-6P.1 28.33,39.09 28.61,39.37 | Q1-6P.3 28.3,37.77 28.61,38.09 28.61,38.77 | 28.61,38.77 28.61,39.37 | 28.61,39.37 28.61,42.55 | 28.61,42.55 28.61,43.16 | 28.61,43.85 28.61,44.73 28.47,44.87
  Top 0.508: C1-2P.2 38.2,82.97 | R8-6P.1 50.8,50.16 R4-6P.1 46.99,51.43 R8-5P.1 43.18,52.7 R4-5P.1 30.31,52.7 | U7-P.4 29.84,59.69 28.89,58.74 28.89,54.61 29.53,53.98 U8-P.4 30.31,52.7 | U9-P.2 50.8,72.39 49.85,73.34 | 65.4,73.34 R4-9P.1 | 30.31,52.7 30.31,46.7
  Top 0.762: C4-9P.2 65.4,73.34
  Top 1.27: R2-9P.1 C2-9P.2 49.85,69.85 49.85,73.34 C3-9P.2 48.26,76.2 44.77,79.69 R2-2P.1 | R2-11P.1 64.14,57.15 | 64.14,57.15 R3-11P.2 66.68,59.06 69.85,62.23 C2-1P.2 | C1-11P.2 64.14,57.15
  Top 1.778: 1S_LIPO.2 93.66,35.56 95.25,37.15 J1-9P.15 89.22,50.8 v82.55,57.47 | JP-CP.3 v66.67,83.82
  Bottom 1.27: v66.67,83.82 65.83,82.97 | 65.83,82.97 C5-2P.2 55.98,82.97 | 55.98,82.97 C4-2P.2 | 55.98,82.97 55.59,82.97 v48.26,90.3 v48.26,83.44 44.77,83.44 | 44.77,83.44 41.11,83.44 C2-2P.2 38.2,82.97 C1-2P.2 35.24,80.01 21.59,80.01 15.24,73.66 R1-5P.1 R5-5P.1 R1-6P.1 v15.24,51.76 | R2-2P.1 44.77,83.44 | R4-9P.1 65.72,82.87 65.83,82.97
  Bottom 1.778: v82.55,57.47 C2-1P.2 77.79,77.92 71.89,83.82 JP-CP.3 | v82.55,57.47 | R8-6P.1 73.97,48.89 v82.55,57.47
  other vias: 58.42,82.97 55.88,82.87 40.64,82.97 38.1,82.87 15.24,55.88 77.79,62.23 44.77,81.28 15.24,65.72 15.24,61.6 65.72,73.02 52.07,48.89
  pour Top (no thermals): 76.96,61.21 78.23,61.21 78.61,61.59 78.61,63.37 78.99,63.75 78.99,70.61 78.74,70.87 75.18,70.87 74.93,70.61 74.93,68.83 75.18,68.58 78.23,68.58 78.49,68.33 78.49,64.01 77.6,63.12 76.96,63.12
  pour Bottom (no thermals): 67.31,84.77 32.7,84.77 30.48,82.55 30.48,80.01 33.02,77.47 62.23,77.47 67.31,82.55
  pour Bottom (no thermals): 17.14,53.34 12.7,53.34 12.7,71.12 15.24,73.66 17.14,71.75
  pour Bottom (no thermals): 12.7,71.12 12.7,76.2 19.05,82.55 38.1,82.55 38.1,78.74 30.48,71.12
  pour Bottom (no thermals): 36.51,84.77 45.72,93.98 50.8,93.98 60.01,84.77
  pour Bottom (no thermals): 17.14,67.63 20.64,71.12 17.14,71.12
  pour Bottom (no thermals): 12.7,53.34 14.61,50.8 17.14,50.8 17.14,53.34
  pour Top (no thermals): 30.48,59.37 29.53,59.37 28.89,58.74 28.89,54.61 29.53,53.98 31.11,53.98 32.07,53.02 49.21,53.02 52.7,49.53 52.7,48.26 51.44,48.26 51.44,49.53 50.8,50.16 48.26,50.16 46.99,51.44 42.23,51.44 41.59,52.07 36.2,52.07 28.26,44.13 27.3,44.13 27.3,58.42 28.89,60.01 30.48,60.01 30.8,59.69
  pour Top (no thermals): 51.28,72.39 50.16,71.28 50.16,73.5
  pour Top (no thermals): 47.78,84.61 47.78,83.9 48.26,83.42 48.26,84.61
  pour Top (no thermals): 82.55,57.47 82.55,53.02 95.25,40.32 95.25,50.8 89.22,50.8
  pour Top (no thermals): 60.01,57.15 65.09,62.23 77.79,62.23 74.61,59.05 68.58,59.05 67.63,59.05 66.67,58.1 65.72,57.15
  pour Bottom (no thermals): 65.72,73.03 60.64,78.11 63.5,80.96 65.72,80.96
  pour Bottom (no thermals): 77.79,62.23 73.98,58.42 73.98,48.9 82.55,57.47 78.11,61.91 77.79,61.91
  pour Bottom (no thermals): 73.98,51.44 73.98,48.9 71.44,48.9
MASTER_RX-2  (via drill 0.35)
  Top 0.762: v57.15,22.86 25.4,22.86 23.5,20.95 J1-CP.2
  Bottom 0.508: 67.94,33.66 67.31,33.02
  Bottom 0.762: J1-9P.7 67.94,33.66 | 67.31,33.02 v57.15,22.86
MASTER_TX-2  (via drill 0.35)
  Top 0.762: J1-CP.3 20.95,20.95 25.4,25.4 v62.23,25.4
  Bottom 0.762: v62.23,25.4 J1-9P.9
N$1  (via drill 3 pad 4)
  other vias: 5.08,5.08
N$2  (via drill 3 pad 4)
  other vias: 71.12,20.95
N$3  (via drill 3 pad 4)
  other vias: 5.08,96.52
N$4  (via drill 3 pad 4)
  other vias: 96.52,96.52
N$5  (via drill 3 pad 4)
  other vias: 96.52,5.08
N$6  (via drill 3 pad 4)
  other vias: 37.47,95.25
RTS  (via drill 0.35)
  Top 0.762: J1-CP.1 v52.07,20.32
  Bottom 0.762: J1-9P.5 v52.07,20.32
SENSE_A  (via drill 0.35)
  Top 0.762: R4-5P.2 R3-5P.2 | R3-5P.2 40.01,48.26 | 40.33,48.26 R3-5P.2
  Bottom 0.762: J3-CP.1 10.16,53.34 13.97,49.53 v39.05,49.53
  pour Top (no thermals): 40.64,51.12 39.05,49.53 40.64,47.94 41.27,48.58 41.27,50.48
SENSE_B  (via drill 0.35)
  Top 0.762: R8-5P.2 R7-5P.2 44.13,46.99
  Bottom 0.762: J3-CP.2 10.16,50.8 12.7,48.26 v42.86,48.26
  pour Top (no thermals): 44.45,49.85 42.86,48.26 44.45,46.67 45.09,47.31 45.09,49.21
SENSE_C  (via drill 0.35)
  Top 0.762: 47.95,48.26 R4-6P.2 R3-6P.2 47.95,45.72
  Bottom 0.762: J3-CP.3 10.16,48.26 11.43,46.99 v46.67,46.99
  pour Top (no thermals): 46.67,46.99 48.26,45.4 48.9,46.04 48.9,47.94 48.26,48.58
SENSE_D  (via drill 0.35)
  Top 0.762: 51.76,44.45 R7-6P.2
  Bottom 0.762: v50.48,45.72 J3-CP.4
  pour Top (no thermals): 52.07,47.31 50.48,45.72 52.07,44.13 52.7,44.77 52.7,46.67
U1P-PROG
  Top 0.508: U1-P.5 76.06,67.29 R2-1P.2
U1P-STAT
  Top 0.508: U1-P.1 75.86,64.79 R1-1P.2
U2P-FB
  Top 0.254: U2-P.15 49.85,83.77 R1-2P.1
  Top 0.508: C3-2P.2 R1-2P.1 R2-2P.2
  pour Top (no thermals): 49.21,84.3 49.21,83.42 48.97,83.19 47.7,81.92 46.04,81.92 46.04,80.57 46.75,80.57 49.29,78.03 50.4,78.03 50.4,83.26 49.37,84.3
U9P-FB
  Top 0.508: 54.63,69.52 54.59,69.52
  Top 1.27: R1-9P.1 C1-9P.2 54.63,69.52 | R2-9P.2 C2-9P.1 54.59,69.52 U9-P.4
  pour Top (no thermals): 53.34,65.41 55.88,65.41 55.88,68.26 54.61,69.53 53.34,68.26
U9P-LX1
  Top 0.254: 47.26,91.25 L1-2P.2
  pour Top (no thermals): 47.78,88.03 47.78,93.19 46.51,93.19 46.51,88.74 47.23,88.03
U9P-LX2
  Top 0.254: 49.26,91.25 L1-2P.1
  pour Top (no thermals): 48.74,88.03 48.74,93.19 50.01,93.19 50.01,88.74 49.29,88.03
U9P-SW
  Top 0.508: U9-P.5 56.09,73.34 L1-9P.1
V_LDO_IN
  Top 0.152: 43.5,83.82 42.86,84.45
  Top 0.254: U2-P.11 46.72,83.82 43.5,83.82
  Top 0.508: C1-2P.1 40.54,84.77 C2-2P.1 | D1-11P.1 64.12,50.8 64.12,53.01 C1-11P.1
  Top 1.778: C2-2P.1 41.06,85.09 42.23,85.09 42.86,84.45 42.86,66.36 58.42,50.8 R1-11P.2 64.12,50.8 | D1-11P.1 64.12,53.01
  pour Top (no thermals): 45.72,83.82 46.53,84.63 46.53,87.71 45.85,88.39 33.78,88.39 31.62,86.23 31.62,84.2 32,83.82
VBAT
  Top 0.508: C2-1P.1 U1-P.3 | 84.8,34.64 R5-11P.1 | 84.77,33.05 84.8,33.02
  Top 1.27: S1-P.P 84.8,30.19 84.8,33.02 | 84.8,36.54 84.8,35.56 84.8,34.64 | R5-11P.1 84.77,33.05
  Top 1.778: C2-1P.1 79.69,41.65 84.8,36.54 | 84.8,35.56 84.8,37.49 88.27,40.96 91.34,40.96 93.19,39.12 93.19,38.19 1S_LIPO.1
  pour Top (no thermals): 79.25,61.21 78.99,61.47 78.99,62.99 79.38,63.37 79.38,65.79 80.01,65.79 80.52,65.28 80.52,61.72 80.01,61.21
  pour Top (no thermals): 84.77,30.16 84.77,37.47 88.27,40.96 90.81,40.96 92.39,39.37 88.9,39.37 88.9,33.02 82.55,26.67 81.28,26.67
  pour Top (no thermals): 84.45,36.83 79.69,41.59 79.69,52.7 91.44,40.96 87.31,36.83
VBAT_AFTER_SWITCH
  Top 0.508: D1-11P.2 66.99,50.8 68.58,50.8 R4-11P.1
  Top 1.27: J2-P.3 10.16,33.02 10.26,33.02 | J2-P.5 15.24,33.02 | J2-P.7 20.32,33.02
  Top 1.778: S1-P.S 81.28,33.02 | 81.28,33.02 81.28,34.61 | 81.28,34.61 68.58,47.31 68.58,50.8 | 81.28,34.61 R5-11P.2 | J2-P.1 10.26,33.02 15.24,33.02 20.32,33.02 81.28,33.02
  pour Top (no thermals): 66.99,38.89 66.99,51.75 68.1,52.86 69.06,52.86 69.06,46.83 81.28,34.61 81.28,29.21 78.9,29.21
  pour Top (no thermals): 6.67,33.02 6.67,19.37 20.32,33.02
  pour Top (no thermals): 17.78,30.48 78.74,30.48 70.48,38.73 66.99,38.73 61.28,33.02 17.78,33.02
VUSB  (via drill 0.35)
  Top 0.508: 76.2,72.39 79.38,72.39 80.33,71.44 C1-1P.1
  Top 1.27: 80.33,71.44 80.33,72.23 v80.17,72.39
  Top 1.778: D1-1P.A 73.66,71.12 74.93,72.39 76.2,72.39 v80.17,72.39
  Bottom 1.778: JP-CP.4 72.53,86.36 80.17,78.72 v80.17,72.39
  pour Top (no thermals): 79.38,66.29 80.01,66.29 81.03,67.31 81.03,72.83 80.69,73.17 79.38,73.17

### Text on the board
tNames: MBATISTICH JKAJI MPARAL | BYPASS SWITCH | POWER | Purdue Space Program Solids SRAD PSD Prototype 1.0
bNames: MBATISTICH JKAJI MPARAL | Purdue Space Program Solids SRAD PSD Prototype 1.0